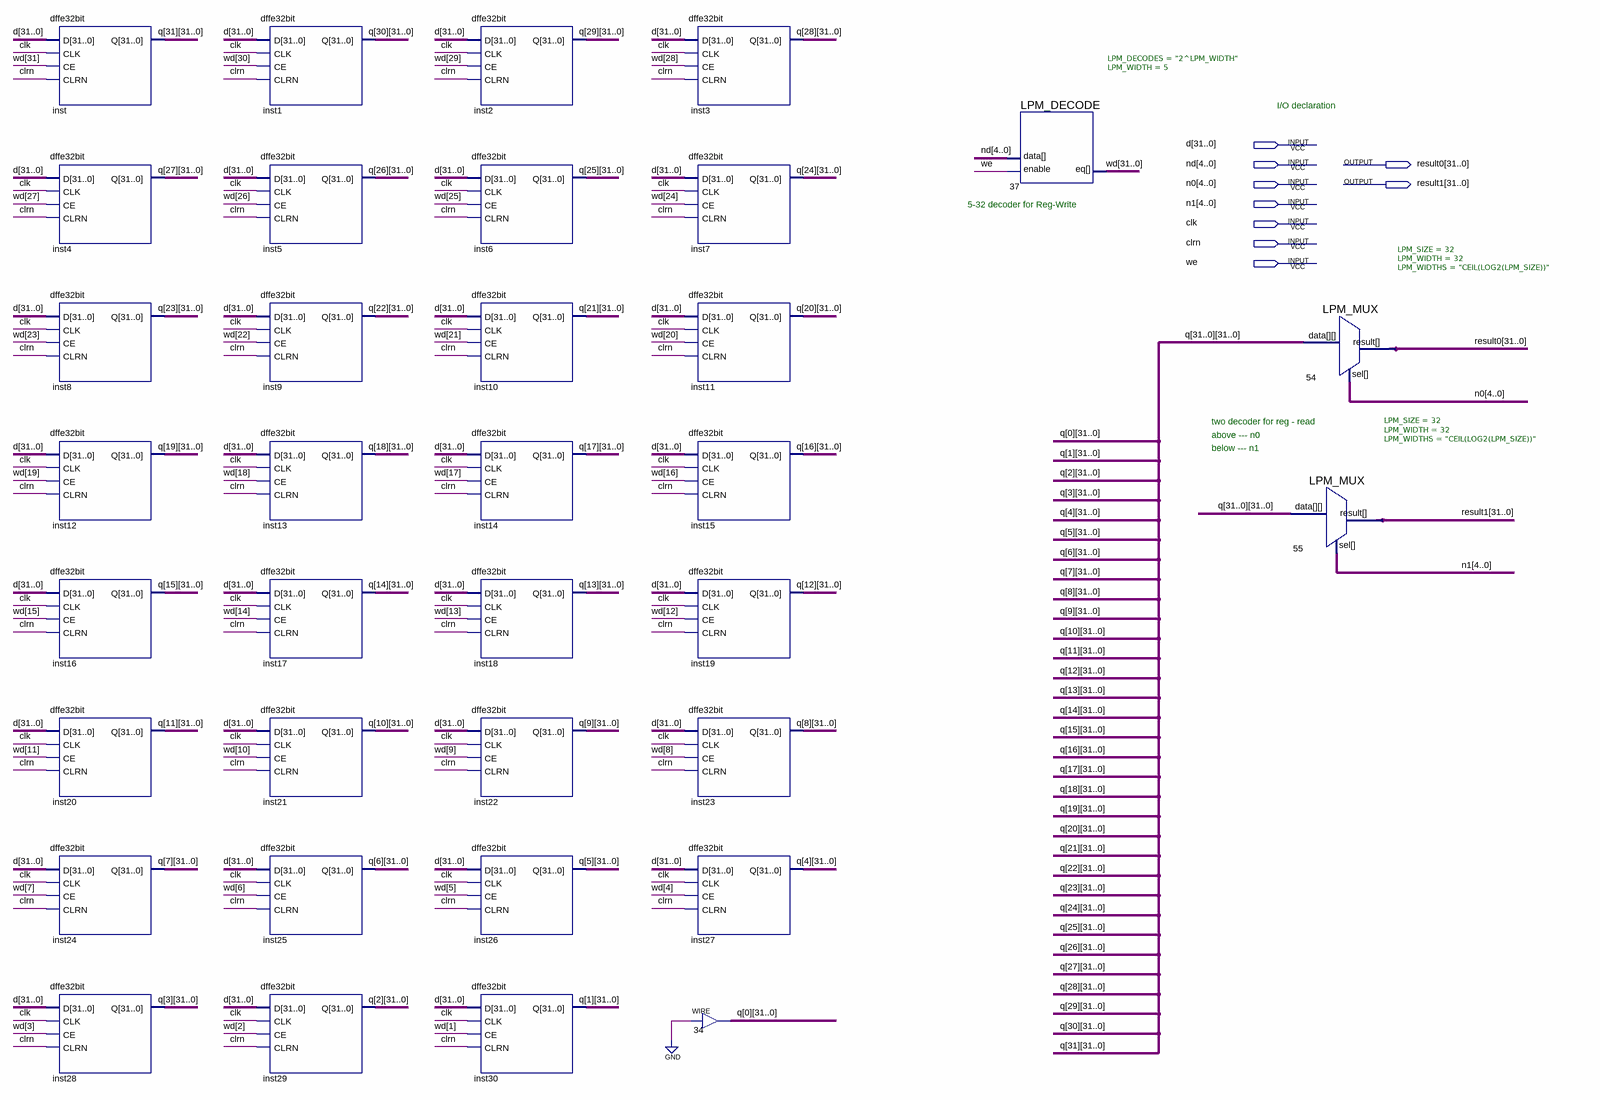
[diagram p0: schematic sheet]
// Quartus schematic RegFile32x32.bdf as structural Verilog: 35 symbols, 9 pins
module RegFile32x32 (
  input  [31:0] d,
  input  [4:0] nd,
  input  [4:0] n0,
  input  [4:0] n1,
  input  clk,
  input  clrn,
  input  we,
  output [31:0] result0,
  output [31:0] result1
);

  wire [31:0] q_0, q_1, q_2, q_3, q_4, q_5, q_6, q_7, q_8, q_9, q_10, q_11, q_12, q_13, q_14, q_15, q_16,
       q_17, q_18, q_19, q_20, q_21, q_22, q_23, q_24, q_25, q_26, q_27, q_28, q_29, q_30, q_31, wd;

  dffe32bit inst (.D(d), .CLK(clk), .CE(wd[31]), .CLRN(clrn), .Q(q_31));
  dffe32bit inst4 (.D(d), .CLK(clk), .CE(wd[27]), .CLRN(clrn), .Q(q_27));
  dffe32bit inst8 (.D(d), .CLK(clk), .CE(wd[23]), .CLRN(clrn), .Q(q_23));
  dffe32bit inst12 (.D(d), .CLK(clk), .CE(wd[19]), .CLRN(clrn), .Q(q_19));
  dffe32bit inst16 (.D(d), .CLK(clk), .CE(wd[15]), .CLRN(clrn), .Q(q_15));
  dffe32bit inst20 (.D(d), .CLK(clk), .CE(wd[11]), .CLRN(clrn), .Q(q_11));
  dffe32bit inst24 (.D(d), .CLK(clk), .CE(wd[7]), .CLRN(clrn), .Q(q_7));
  dffe32bit inst28 (.D(d), .CLK(clk), .CE(wd[3]), .CLRN(clrn), .Q(q_3));
  dffe32bit inst1 (.D(d), .CLK(clk), .CE(wd[30]), .CLRN(clrn), .Q(q_30));
  dffe32bit inst5 (.D(d), .CLK(clk), .CE(wd[26]), .CLRN(clrn), .Q(q_26));
  dffe32bit inst9 (.D(d), .CLK(clk), .CE(wd[22]), .CLRN(clrn), .Q(q_22));
  dffe32bit inst13 (.D(d), .CLK(clk), .CE(wd[18]), .CLRN(clrn), .Q(q_18));
  dffe32bit inst17 (.D(d), .CLK(clk), .CE(wd[14]), .CLRN(clrn), .Q(q_14));
  dffe32bit inst21 (.D(d), .CLK(clk), .CE(wd[10]), .CLRN(clrn), .Q(q_10));
  dffe32bit inst25 (.D(d), .CLK(clk), .CE(wd[6]), .CLRN(clrn), .Q(q_6));
  dffe32bit inst29 (.D(d), .CLK(clk), .CE(wd[2]), .CLRN(clrn), .Q(q_2));
  dffe32bit inst2 (.D(d), .CLK(clk), .CE(wd[29]), .CLRN(clrn), .Q(q_29));
  dffe32bit inst6 (.D(d), .CLK(clk), .CE(wd[25]), .CLRN(clrn), .Q(q_25));
  dffe32bit inst10 (.D(d), .CLK(clk), .CE(wd[21]), .CLRN(clrn), .Q(q_21));
  dffe32bit inst14 (.D(d), .CLK(clk), .CE(wd[17]), .CLRN(clrn), .Q(q_17));
  dffe32bit inst18 (.D(d), .CLK(clk), .CE(wd[13]), .CLRN(clrn), .Q(q_13));
  dffe32bit inst22 (.D(d), .CLK(clk), .CE(wd[9]), .CLRN(clrn), .Q(q_9));
  dffe32bit inst26 (.D(d), .CLK(clk), .CE(wd[5]), .CLRN(clrn), .Q(q_5));
  dffe32bit inst30 (.D(d), .CLK(clk), .CE(wd[1]), .CLRN(clrn), .Q(q_1));
  dffe32bit inst3 (.D(d), .CLK(clk), .CE(wd[28]), .CLRN(clrn), .Q(q_28));
  dffe32bit inst7 (.D(d), .CLK(clk), .CE(wd[24]), .CLRN(clrn), .Q(q_24));
  dffe32bit inst11 (.D(d), .CLK(clk), .CE(wd[20]), .CLRN(clrn), .Q(q_20));
  dffe32bit inst15 (.D(d), .CLK(clk), .CE(wd[16]), .CLRN(clrn), .Q(q_16));
  dffe32bit inst19 (.D(d), .CLK(clk), .CE(wd[12]), .CLRN(clrn), .Q(q_12));
  dffe32bit inst23 (.D(d), .CLK(clk), .CE(wd[8]), .CLRN(clrn), .Q(q_8));
  dffe32bit inst27 (.D(d), .CLK(clk), .CE(wd[4]), .CLRN(clrn), .Q(q_4));
  assign q_0 = {32{1'b0}};  // WIRE 34
  LPM_DECODE #(.LPM_DECODES("2^LPM_WIDTH"), .LPM_WIDTH(5)) u_37 (.enable(we), .data(nd), .eq(wd));
  LPM_MUX #(.LPM_SIZE(32), .LPM_WIDTH(32), .LPM_WIDTHS("CEIL(LOG2(LPM_SIZE))")) u_55 (
    .data({q_31, q_30, q_29, q_28, q_27, q_26, q_25, q_24, q_23, q_22, q_21, q_20, q_19, q_18, q_17, q_16, q_15, q_14, q_13, q_12, q_11, q_10, q_9, q_8, q_7, q_6, q_5, q_4, q_3, q_2, q_1, q_0}),
    .sel(n1), .result(result1));
  LPM_MUX #(.LPM_SIZE(32), .LPM_WIDTH(32), .LPM_WIDTHS("CEIL(LOG2(LPM_SIZE))")) u_54 (
    .data({q_31, q_30, q_29, q_28, q_27, q_26, q_25, q_24, q_23, q_22, q_21, q_20, q_19, q_18, q_17, q_16, q_15, q_14, q_13, q_12, q_11, q_10, q_9, q_8, q_7, q_6, q_5, q_4, q_3, q_2, q_1, q_0}),
    .sel(n0), .result(result0));

  // Notes on the sheet:
  //   I/O declaration
  //   5-32 decoder for Reg-Write
  //   two decoder for reg - read
  //   above --- n0
  //   below --- n1
endmodule
